# Altium schematic sheet motor-driver.schdoc: DRV
size A4; Date: 10.25.2025; CheckedBy: BCY; DrawnBy: miaow; DocumentNumber: 9; Revision: v1.0.0; SheetNumber: 9; SheetTotal: 14; BoardType: MAIN_PCB; Desc: PMSM & BLDC driver
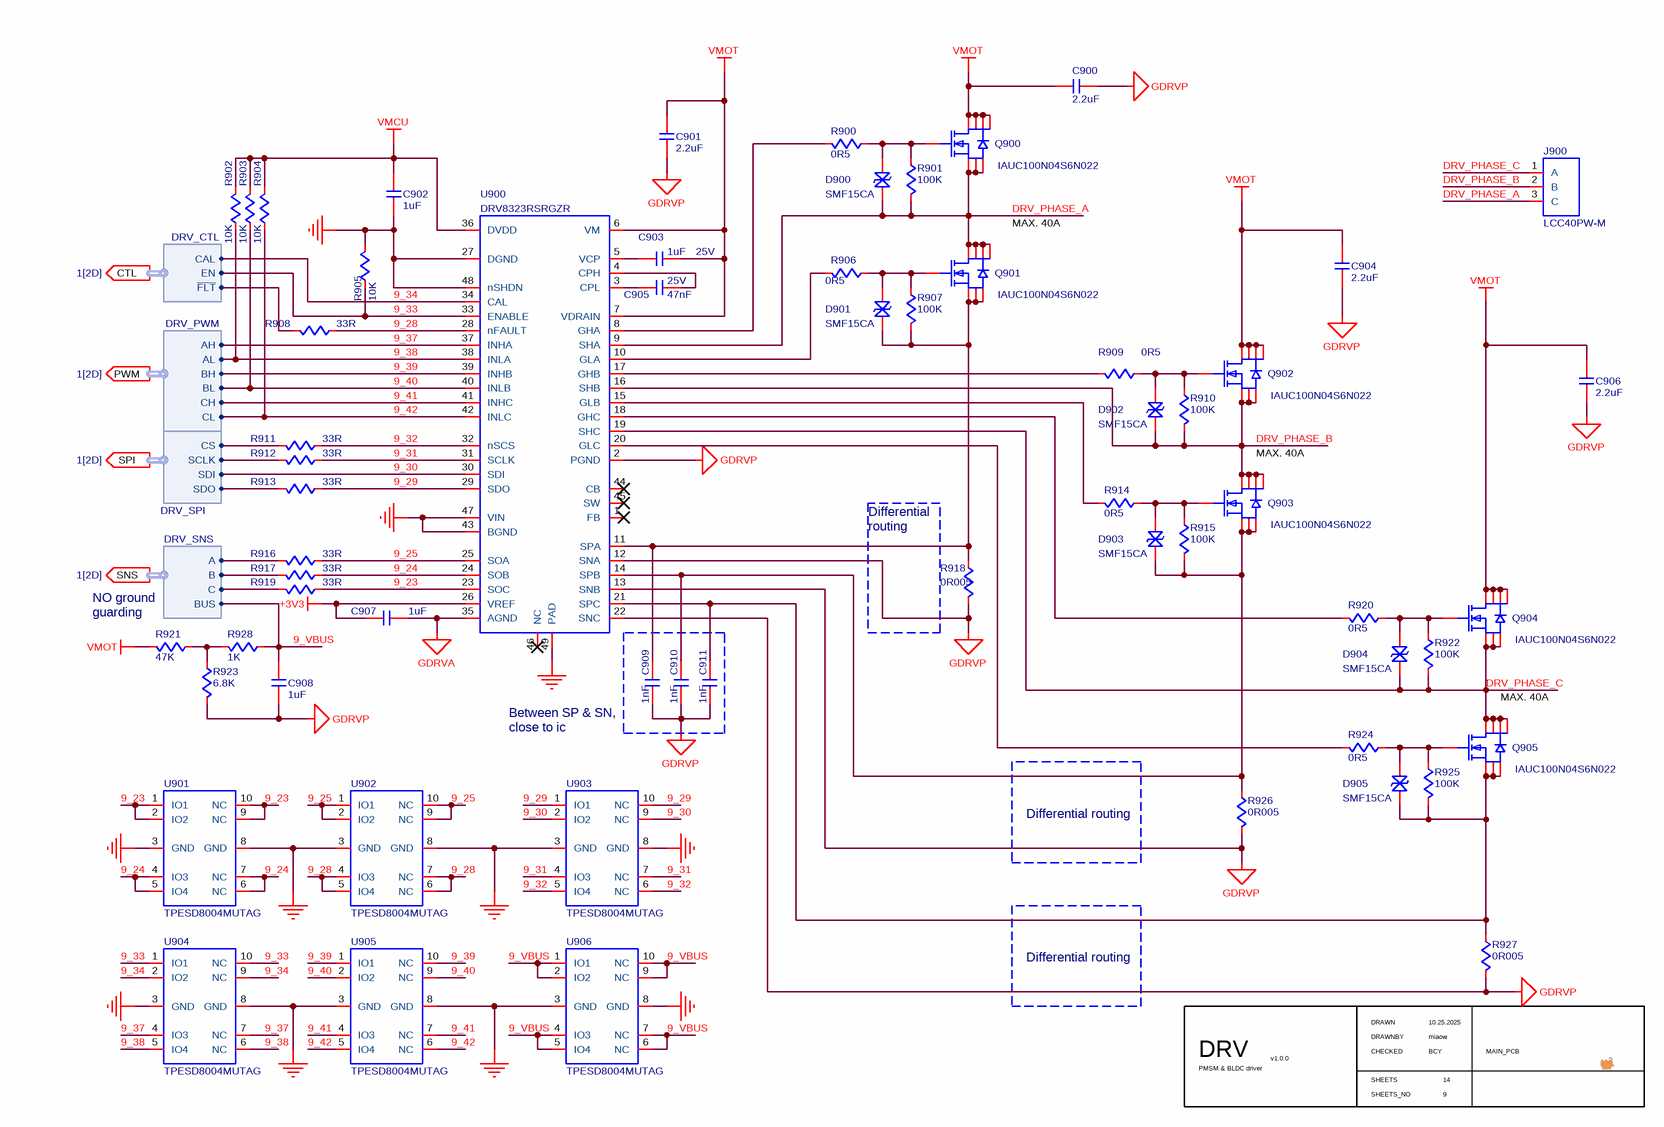
[diagram p0: motor-driver.schdoc]

## Parts
C900  value 2.2uF  [C0603]  (hidden comment: C-NOMO)
C901  value 2.2uF  [C0603]  (hidden comment: C-NOMO)
C902  value 1uF  [C0402]  (hidden comment: C-NOMO)
C903  value 1uF  voltage: 25V  [C0402]  (hidden comment: C-NOMO)
C904  value 2.2uF  [C0603]  (hidden comment: C-NOMO)
C905  value 47nF  voltage: 25V  [C0402]  (hidden comment: C-NOMO)
C906  value 2.2uF  [C0603]  (hidden comment: C-NOMO)
C907  value 1uF  [C0402]  (hidden comment: C-NOMO)
C908  value 1uF  [C0603]  (hidden comment: C-NOMO)
C909  value 1nF  [C0402]  (hidden comment: C-NOMO)
C910  value 1nF  [C0402]  (hidden comment: C-NOMO)
C911  value 1nF  [C0402]  (hidden comment: C-NOMO)
D900  SMF15CA  [SMF15CA]
D901  SMF15CA  [SMF15CA]
D902  SMF15CA  [SMF15CA]
D903  SMF15CA  [SMF15CA]
D904  SMF15CA  [SMF15CA]
D905  SMF15CA  [SMF15CA]
J900  LCC40PW-M  [LCC40PW-M]
Q900  IAUC100N04S6N022  [IAUC100N04S6N022]
Q901  IAUC100N04S6N022  [IAUC100N04S6N022]
Q902  IAUC100N04S6N022  [IAUC100N04S6N022]
Q903  IAUC100N04S6N022  [IAUC100N04S6N022]
Q904  IAUC100N04S6N022  [IAUC100N04S6N022]
Q905  IAUC100N04S6N022  [IAUC100N04S6N022]
R900  value 0R5  [R0402]  (hidden comment: R)
R901  value 100K  [R0603]  (hidden comment: R)
R902  value 10K  [R0402]  (hidden comment: R)
R903  value 10K  [R0402]  (hidden comment: R)
R904  value 10K  [R0402]  (hidden comment: R)
R905  value 10K  [R0402]  (hidden comment: R)
R906  value 0R5  [R0402]  (hidden comment: R)
R907  value 100K  [R0603]  (hidden comment: R)
R908  value 33R  [R0402]  (hidden comment: R)
R909  value 0R5  [R0402]  (hidden comment: R)
R910  value 100K  [R0603]  (hidden comment: R)
R911  value 33R  [R0402]  (hidden comment: R)
R912  value 33R  [R0402]  (hidden comment: R)
R913  value 33R  [R0402]  (hidden comment: R)
R914  value 0R5  [R0402]  (hidden comment: R)
R915  value 100K  [R0603]  (hidden comment: R)
R916  value 33R  [R0402]  (hidden comment: R)
R917  value 33R  [R0402]  (hidden comment: R)
R918  value 0R005  [R2512]  (hidden comment: R)
R919  value 33R  [R0402]  (hidden comment: R)
R920  value 0R5  [R0402]  (hidden comment: R)
R921  value 47K  [R0603]  (hidden comment: R)
R922  value 100K  [R0603]  (hidden comment: R)
R923  value 6.8K  [R0603]  (hidden comment: R)
R924  value 0R5  [R0402]  (hidden comment: R)
R925  value 100K  [R0603]  (hidden comment: R)
R926  value 0R005  [R2512]  (hidden comment: R)
R927  value 0R005  [R2512]  (hidden comment: R)
R928  value 1K  [R0603]  (hidden comment: R)
U900  DRV8323RSRGZR  [DRV8323RSRGZR]
U901  TPESD8004MUTAG  [TPESD8004MUTAG]
U902  TPESD8004MUTAG  [TPESD8004MUTAG]
U903  TPESD8004MUTAG  [TPESD8004MUTAG]
U904  TPESD8004MUTAG  [TPESD8004MUTAG]
U905  TPESD8004MUTAG  [TPESD8004MUTAG]
U906  TPESD8004MUTAG  [TPESD8004MUTAG]

## Ports
CTL (out, harness DRV_CTL, see 1[2D]), PWM (out, harness DRV_PWM, see 1[2D]), SNS (out, harness DRV_SNS, see 1[2D]), SPI (out, harness DRV_SPI, see 1[2D])

## Harnesses
DRV_CTL: CAL, EN, ~{FLT}
DRV_SNS: C, B, A, BUS
DRV_SPI: CS, SCLK, SDI, SDO
DRV_PWM: AH, AL, BH, BL, CH, CL

## Nets
+3V3: C907.1 U900.26(VREF)
GDRVA: C907.2 U900.35(AGND)
GDRVP: C900.1 C901.1 C904.1 C906.1 C908.2 C909.1 C910.1 C911.1 R918.1 R923.1 R926.1 R927.1 U900.2(PGND) U900.12(SNA) U900.13(SNB) U900.22(SNC)
GND: C902.1 R905.1 U900.27(DGND) U900.43(BGND) U900.47(VIN) U900.48(nSHDN) U900.49(PAD) U901.3(GND) U901.8(GND) U902.3(GND) U902.8(GND) U903.3(GND) U903.8(GND) U904.3(GND) U904.8(GND) U905.3(GND) U905.8(GND) U906.3(GND) U906.8(GND)
VMCU: C902.2 R902.1 R903.1 R904.1 U900.36(DVDD)
VMOT: C900.2 C901.2 C903.2 C904.2 C906.2 Q900.5(D) Q900.6(D) Q900.7(D) Q900.8(D) Q902.5(D) Q902.6(D) Q902.7(D) Q902.8(D) Q904.5(D) Q904.6(D) Q904.7(D) Q904.8(D) R921.1 U900.6(VM) U900.7(VDRAIN)
9_23: R919.2 U900.23(SOC) U901.1(IO1) U901.2(IO2) U901.9(NC) U901.10(NC)
9_24: R917.2 U900.24(SOB) U901.4(IO3) U901.5(IO4) U901.6(NC) U901.7(NC)
9_25: R916.2 U900.25(SOA) U902.1(IO1) U902.2(IO2) U902.9(NC) U902.10(NC)
9_28: R908.2 U900.28(nFAULT) U902.4(IO3) U902.5(IO4) U902.6(NC) U902.7(NC)
9_29: R913.2 U900.29(SDO) U903.1(IO1) U903.10(NC)
9_30: U900.30(SDI) U903.2(IO2) U903.9(NC) ; port SPI.SDI
9_31: R912.2 U900.31(SCLK) U903.4(IO3) U903.7(NC)
9_32: R911.2 U900.32(nSCS) U903.5(IO4) U903.6(NC)
9_33: R905.2 U900.33(ENABLE) U904.1(IO1) U904.10(NC) ; port CTL.EN
9_34: U900.34(CAL) U904.2(IO2) U904.9(NC) ; port CTL.CAL
9_37: U900.37(INHA) U904.4(IO3) U904.7(NC) ; port PWM.AH
9_38: R902.2 U900.38(INLA) U904.5(IO4) U904.6(NC) ; port PWM.AL
9_39: U900.39(INHB) U905.1(IO1) U905.10(NC) ; port PWM.BH
9_40: R903.2 U900.40(INLB) U905.2(IO2) U905.9(NC) ; port PWM.BL
9_41: U900.41(INHC) U905.4(IO3) U905.7(NC) ; port PWM.CH
9_42: R904.2 U900.42(INLC) U905.5(IO4) U905.6(NC) ; port PWM.CL
9_VBUS: C908.1 R928.2 U906.1(IO1) U906.2(IO2) U906.4(IO3) U906.5(IO4) U906.6(NC) U906.7(NC) U906.9(NC) U906.10(NC) ; port SNS.BUS
DRV_PHASE_A: D900.1 J900.3(C) Q900.1(S) Q900.2(S) Q900.3(S) Q901.5(D) Q901.6(D) Q901.7(D) Q901.8(D) R901.1 U900.9(SHA)
DRV_PHASE_B: D902.1 J900.2(B) Q902.1(S) Q902.2(S) Q902.3(S) Q903.5(D) Q903.6(D) Q903.7(D) Q903.8(D) R910.1 U900.16(SHB)
DRV_PHASE_C: D904.1 J900.1(A) Q904.1(S) Q904.2(S) Q904.3(S) Q905.5(D) Q905.6(D) Q905.7(D) Q905.8(D) R922.1 U900.19(SHC)
NetC903_1: C903.1 U900.5(VCP)
NetC905_1: C905.1 U900.3(CPL)
NetC905_2: C905.2 U900.4(CPH)
NetC909_2: C909.2 D901.1 Q901.1(S) Q901.2(S) Q901.3(S) R907.1 R918.2 U900.11(SPA)
NetC910_2: C910.2 D903.1 Q903.1(S) Q903.2(S) Q903.3(S) R915.1 R926.2 U900.14(SPB)
NetC911_2: C911.2 D905.1 Q905.1(S) Q905.2(S) Q905.3(S) R925.1 R927.2 U900.21(SPC)
NetD900_2: D900.2 Q900.4(G) R900.2 R901.2
NetD901_2: D901.2 Q901.4(G) R906.2 R907.2
NetD902_2: D902.2 Q902.4(G) R909.2 R910.2
NetD903_2: D903.2 Q903.4(G) R914.2 R915.2
NetD904_2: D904.2 Q904.4(G) R920.2 R922.2
NetD905_2: D905.2 Q905.4(G) R924.2 R925.2
NetR900_1: R900.1 U900.8(GHA)
NetR906_1: R906.1 U900.10(GLA)
NetR908_1: R908.1 ; port CTL.~{FLT}
NetR909_1: R909.1 U900.17(GHB)
NetR911_1: R911.1 ; port SPI.CS
NetR912_1: R912.1 ; port SPI.SCLK
NetR913_1: R913.1 ; port SPI.SDO
NetR914_1: R914.1 U900.15(GLB)
NetR916_1: R916.1 ; port SNS.A
NetR917_1: R917.1 ; port SNS.B
NetR919_1: R919.1 ; port SNS.C
NetR920_1: R920.1 U900.18(GHC)
NetR921_2: R921.2 R923.2 R928.1
NetR924_1: R924.1 U900.20(GLC)

Not connected (* = marked no-connect by the designer): U900 1(FB)* 44(CB)* 45(SW)* 46(NC)*

## Notes on the sheet
- (near Q901) MAX. 40A
- (near Q903) MAX. 40A
- (near R918) Differential routing
- (near R921) NO ground guarding
- (near Q905) MAX. 40A
- (near C909) Between SP & SN, close to ic
- Differential routing
- DRAWN
- CHECKED
- DRAWNBY
- SHEETS
- SHEETS_NO

## Library data of the parts
C900-C902 C904 C906-C911 = C-NOMO: voltage: 25V; precision: 5%
C903 C905 = C-NOMO: precision: 5%
D900-D905 = SMF15CA: TVS/ESD; Supplier 1: LCSC; Supplier Part Number 1: C123803
J900 = LCC40PW-M: CONNECTOR - 3pin, power; Supplier 1: LCSC; Supplier Part Number 1: C7437310
R900-R928 = R: precision: 1%
U901-U906 = TPESD8004MUTAG: TVS/ESD; Supplier 1: LCSC; Supplier Part Number 1: C2827679
Q900-Q905 = IAUC100N04S6N022: Supplier 1: LCSC; Supplier Part Number 1: C535695
U900 = DRV8323RSRGZR: Supplier 1: LCSC; Supplier Part Number 1: C545497